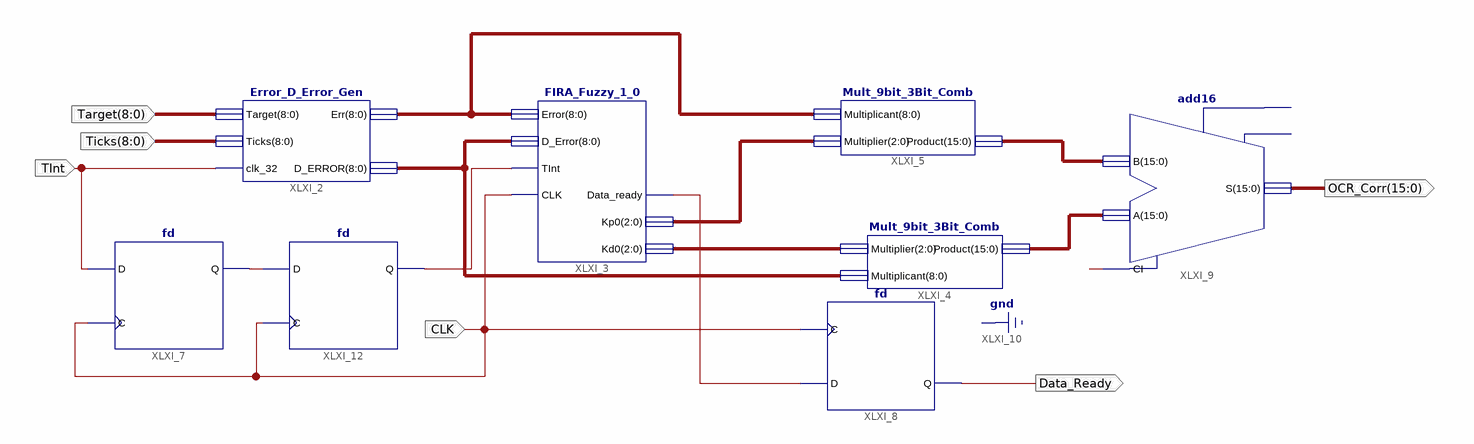
[diagram p0: schematic sheet 1]
// Xilinx ISE schematic Fuzzy_PID.sch (spartan3e) as structural Verilog: 8 symbols, 6 ports
module Fuzzy_PID (
  input  [8:0] Target,
  input  [8:0] Ticks,
  input  TInt,
  input  CLK,
  output Data_Ready,
  output [15:0] OCR_Corr
);

  wire XLXN_27, XLXN_40, XLXN_42;
  wire [2:0] XLXN_1, XLXN_4;
  wire [8:0] XLXN_5, XLXN_7;
  wire [15:0] XLXN_29, XLXN_30;

  Error_D_Error_Gen XLXI_2 (.clk_32(TInt), .Ticks(Ticks), .Target(Target), .D_ERROR(XLXN_7), .Err(XLXN_5));
  FIRA_Fuzzy_1_0 XLXI_3 (
    .Error(XLXN_5), .D_Error(XLXN_7), .TInt(XLXN_42), .CLK(CLK), .Data_ready(XLXN_27), .Kp0(XLXN_4),
    .Kd0(XLXN_1));
  Mult_9bit_3Bit_Comb XLXI_4 (.Multiplier(XLXN_1), .Multiplicant(XLXN_7), .Product(XLXN_30));
  Mult_9bit_3Bit_Comb XLXI_5 (.Multiplier(XLXN_4), .Multiplicant(XLXN_5), .Product(XLXN_29));
  fd XLXI_8 (.C(CLK), .D(XLXN_27), .Q(Data_Ready));
  add16 XLXI_9 (.A(XLXN_30), .B(XLXN_29), .CI(1'b0), .S(OCR_Corr));  // open: CO, OFL
  fd XLXI_7 (.C(CLK), .D(TInt), .Q(XLXN_40));
  fd XLXI_12 (.C(CLK), .D(XLXN_40), .Q(XLXN_42));
endmodule
